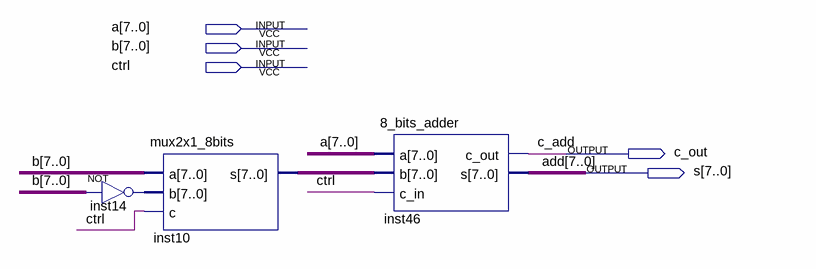
[diagram p0: schematic sheet]
// Quartus schematic add_sub.bdf as structural Verilog: 3 symbols, 5 pins
module add_sub (
  input  [7:0] a,
  input  [7:0] b,
  input  ctrl,
  output c_out,
  output [7:0] s
);

  wire [7:0] inst10_s, inst14_out;

  mux2x1_8bits inst10 (.a(b), .b(inst14_out), .c(ctrl), .s(inst10_s));
  assign inst14_out = ~b;  // NOT inst14, 8 bits wide
  \8_bits_adder  inst46 (.a(a), .b(inst10_s), .c_in(ctrl), .c_out(c_out), .s(s));

  // Other names for the same wires on the sheet: add[7:0] = s; c_add = c_out
endmodule
